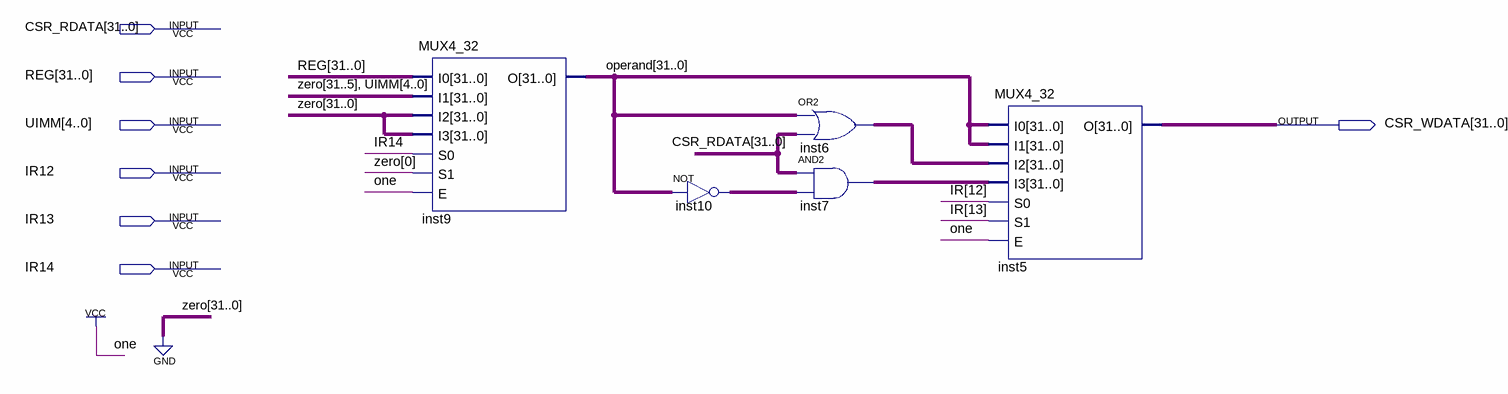
[diagram p0: schematic sheet]
// Quartus schematic CSRWriteData.bdf as structural Verilog: 5 symbols, 7 pins
module CSRWriteData (
  input  [31:0] CSR_RDATA,
  input  [31:0] REG,
  input  [4:0] UIMM,
  input  IR12,
  input  IR13,
  input  IR14,
  output [31:0] CSR_WDATA
);

  wire [31:0] inst6_out, inst7_out, inst10_out, operand;

  MUX4_32 inst9 (
    .I0(REG), .I1({{27{1'b0}}, UIMM}), .I2({32{1'b0}}), .I3({32{1'b0}}), .S0(IR14), .S1(1'b0), .E(1'b1),
    .O(operand));
  assign inst10_out = ~operand;  // NOT inst10, 32 bits wide
  assign inst6_out = operand | CSR_RDATA;  // OR2 inst6, 32 bits wide
  assign inst7_out = CSR_RDATA & inst10_out;  // AND2 inst7, 32 bits wide
  MUX4_32 inst5 (
    .I0(operand), .I1(operand), .I2(inst6_out), .I3(inst7_out), .S0(IR12), .S1(IR13), .E(1'b1), .O(CSR_WDATA));
endmodule
